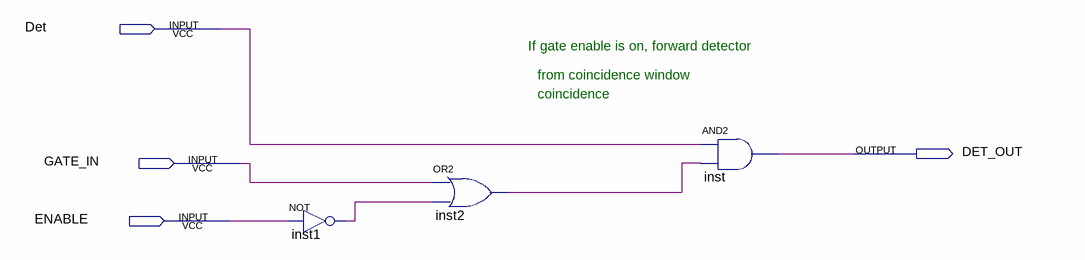
[diagram p0: schematic sheet]
// Quartus schematic singlesTotal.bdf as structural Verilog: 3 symbols, 4 pins
module singlesTotal (
  input  Det,
  input  GATE_IN,
  input  ENABLE,
  output DET_OUT
);

  wire inst1_out, inst2_out;

  not inst1 (inst1_out, ENABLE);
  or inst2 (inst2_out, GATE_IN, inst1_out);
  and inst (DET_OUT, Det, inst2_out);

  // Notes on the sheet:
  //   If gate enable is on, forward detector
  //   from coincidence window
  //   coincidence
endmodule
